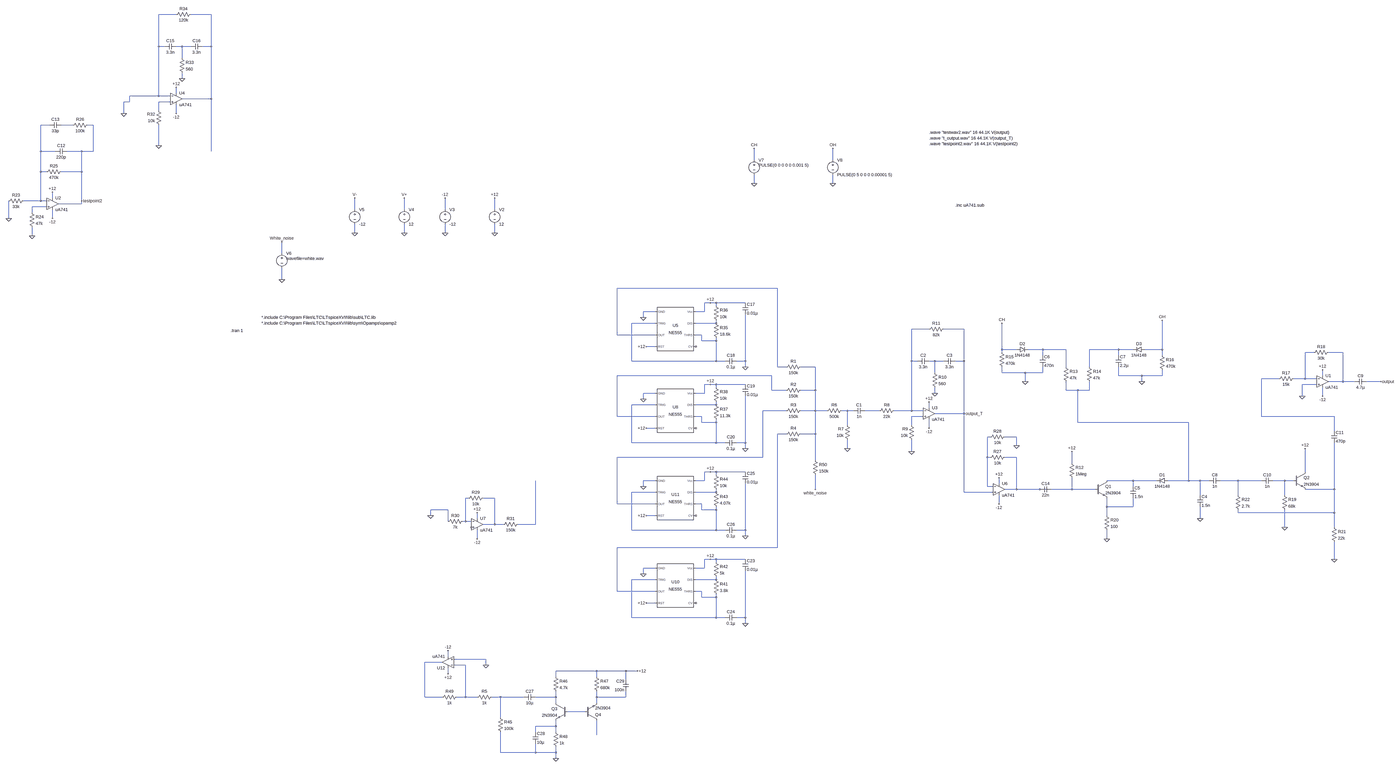
[diagram p0: schematic Hi Hat Cymbal (With white noise wave file).asc, whole sheet]
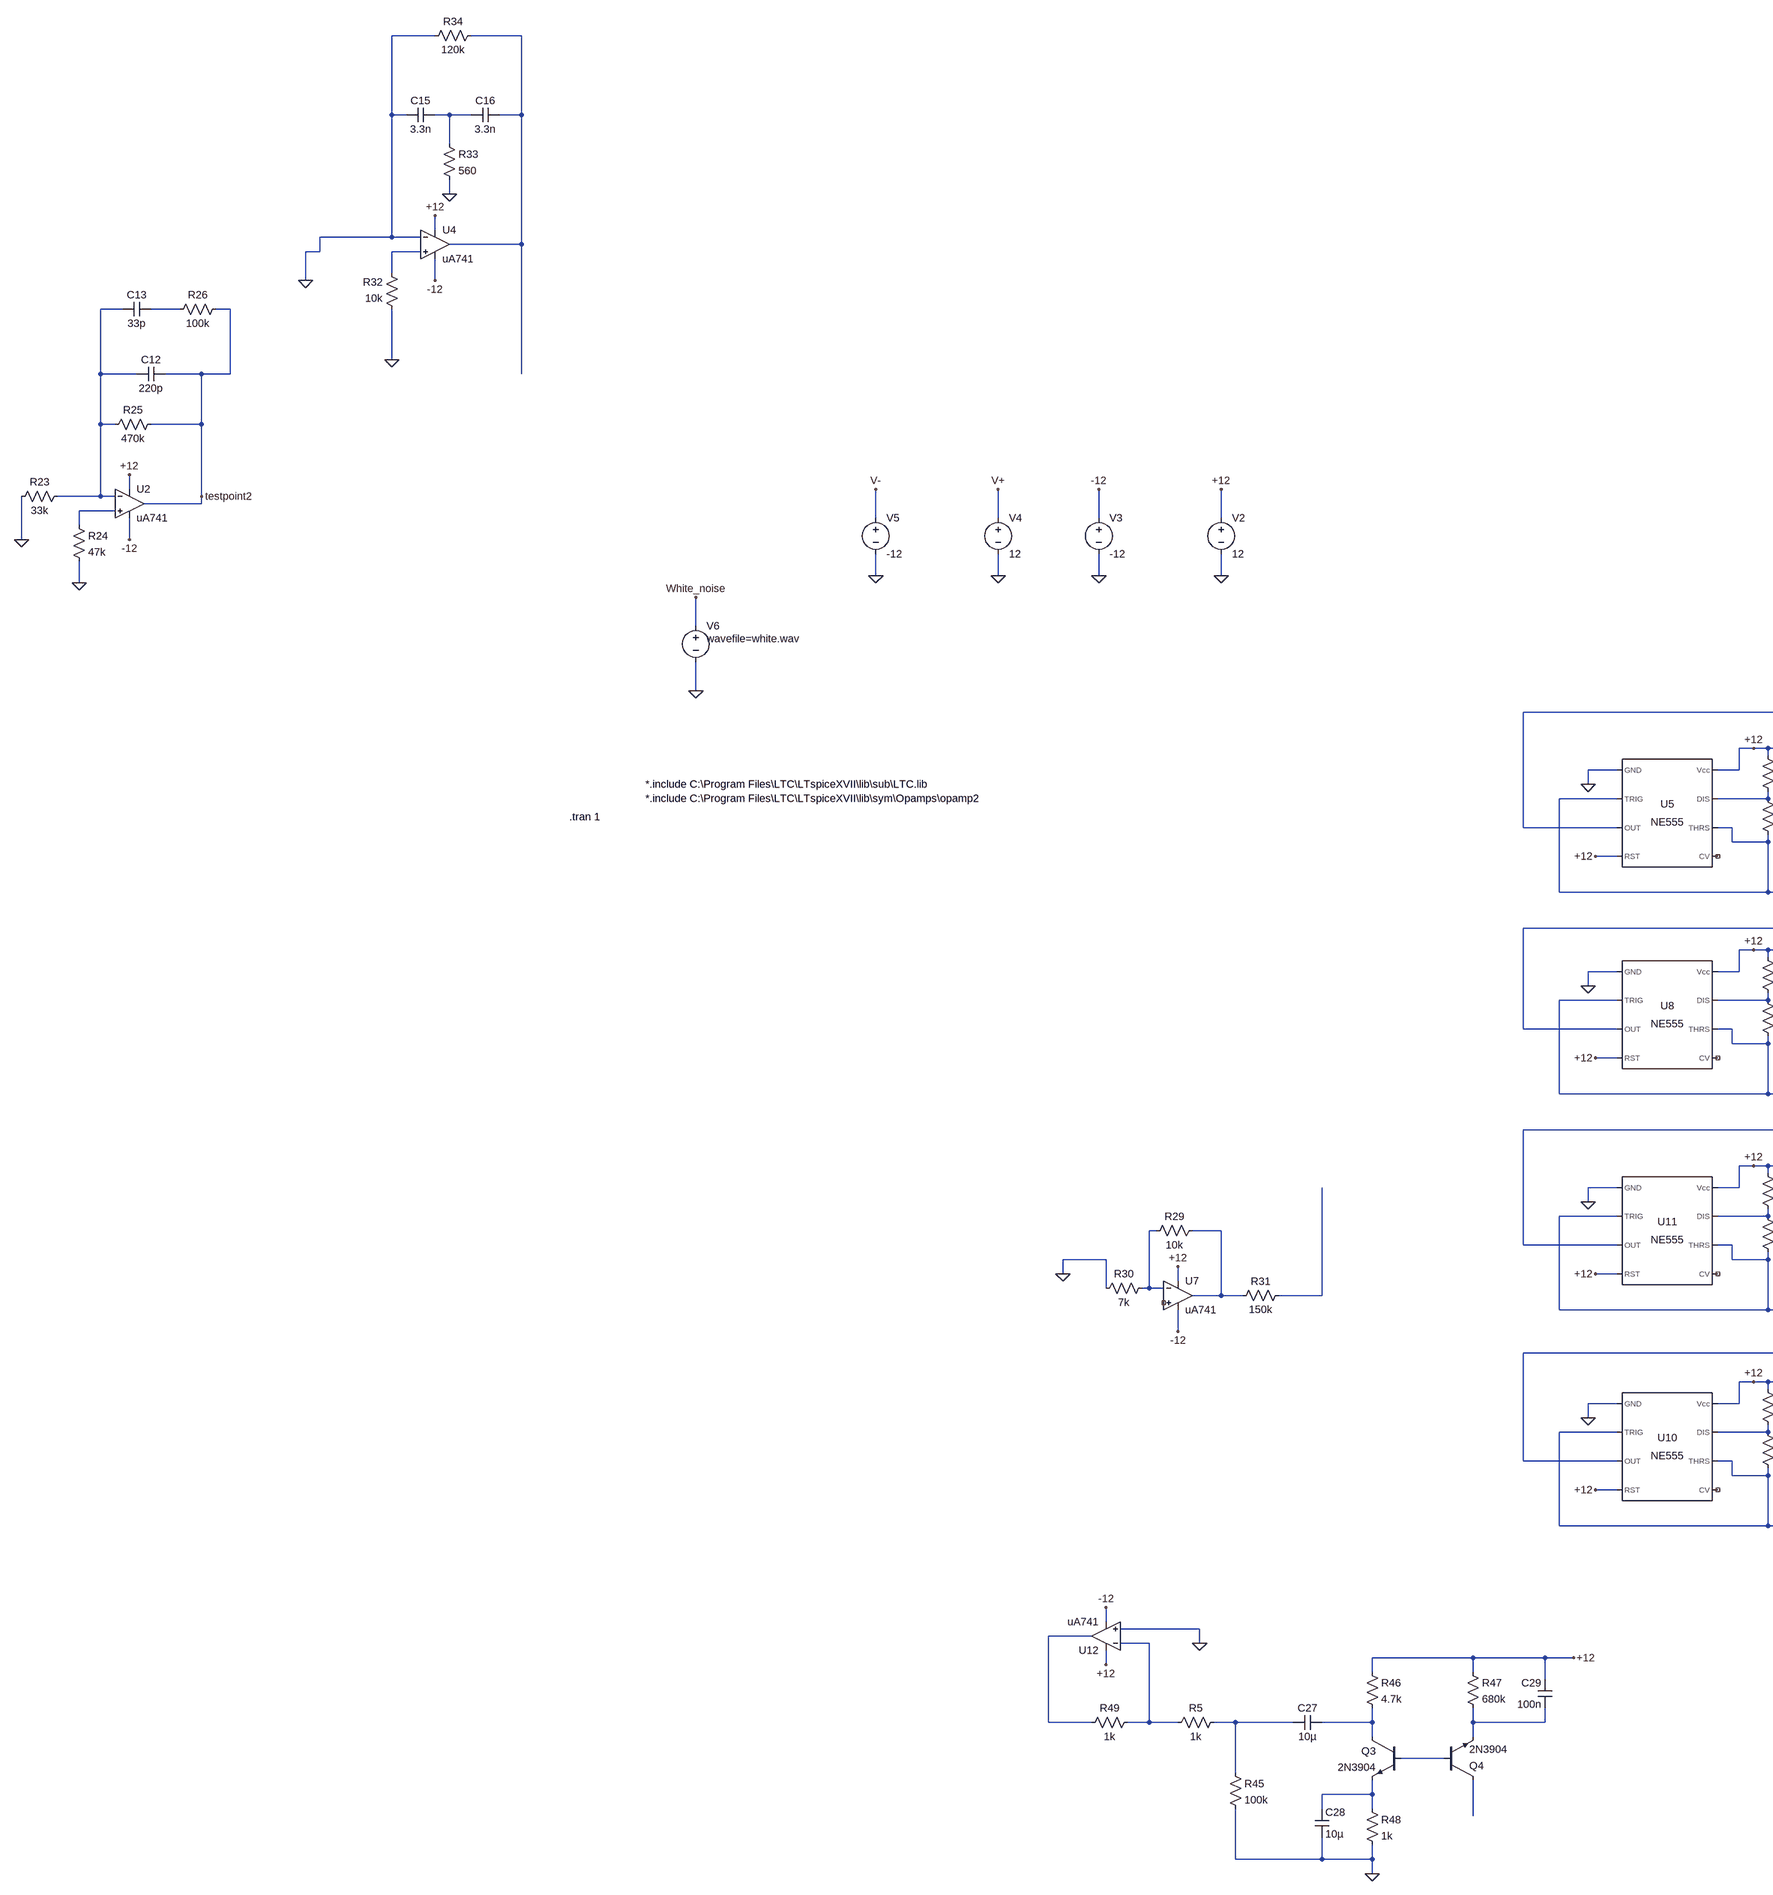
[diagram p1: schematic Hi Hat Cymbal (With white noise wave file).asc, part, row 1 of 1, column 1 of 2]
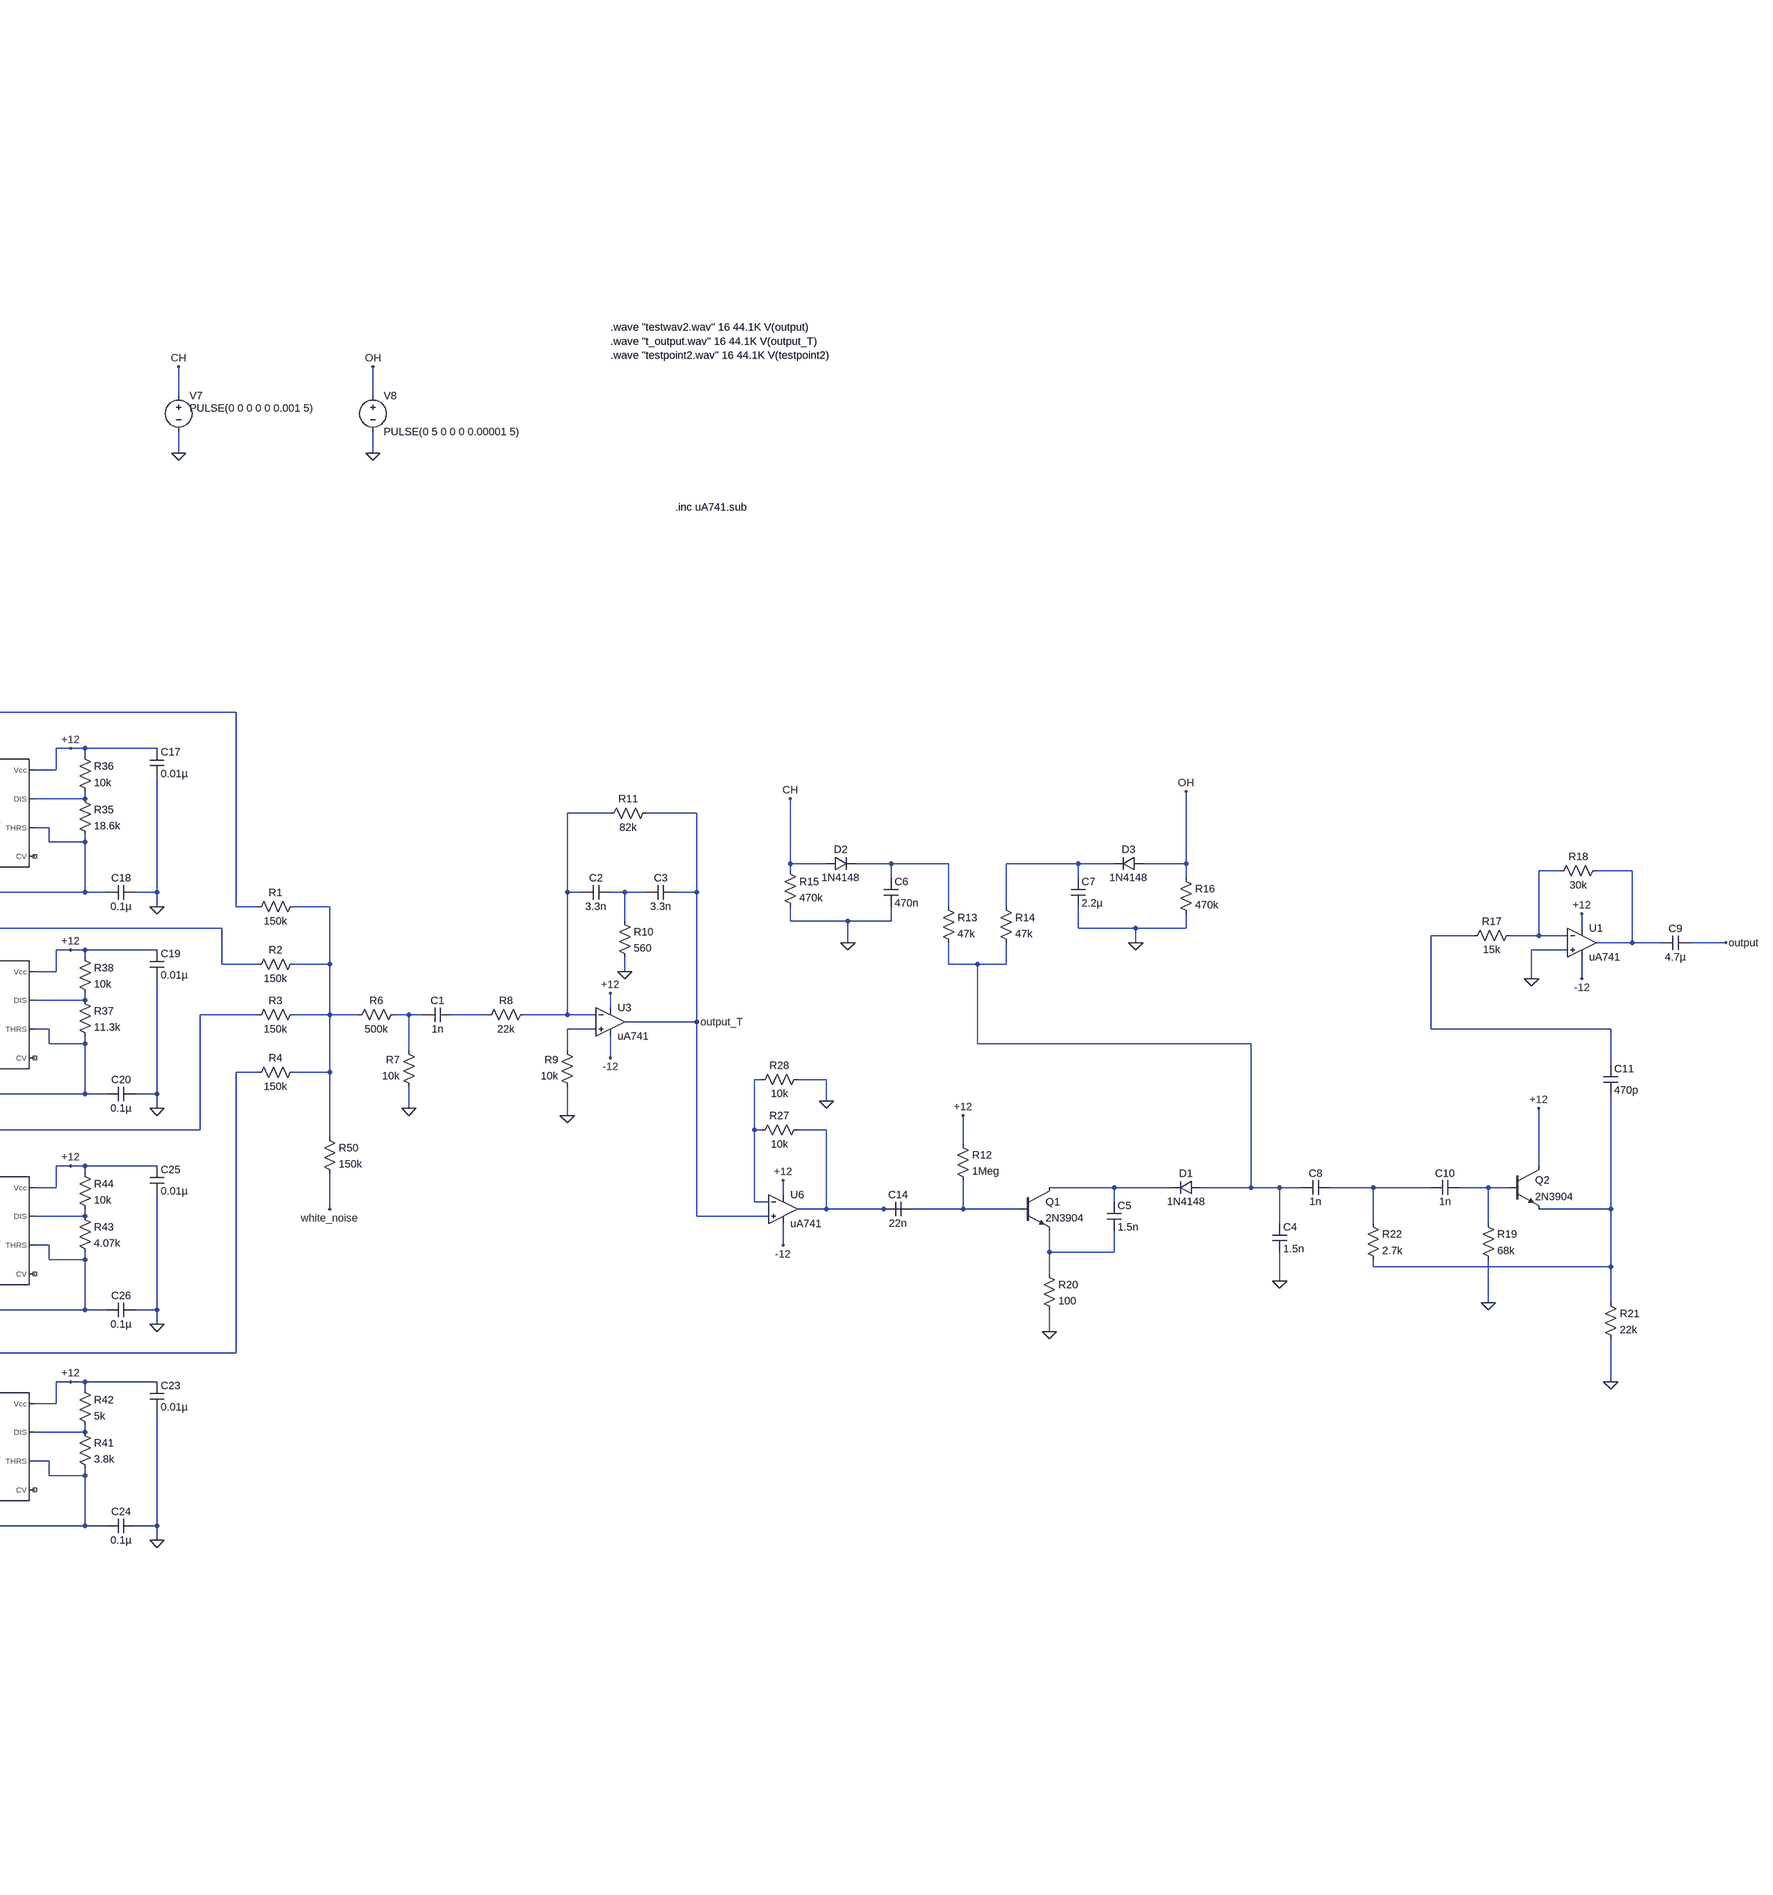
[diagram p2: schematic Hi Hat Cymbal (With white noise wave file).asc, part, row 1 of 1, column 2 of 2]
Hi Hat Cymbal (With white noise wave file).asc, the LTspice schematic file:
Version 4
SHEET 1 5820 2708
WIRE -4880 -1824 -4976 -1824
WIRE -4688 -1824 -4800 -1824
WIRE -4976 -1648 -4976 -1824
WIRE -4944 -1648 -4976 -1648
WIRE -4848 -1648 -4880 -1648
WIRE -4800 -1648 -4848 -1648
WIRE -4688 -1648 -4688 -1824
WIRE -4688 -1648 -4736 -1648
WIRE -4848 -1584 -4848 -1648
WIRE -4848 -1472 -4848 -1504
WIRE -4880 -1392 -4880 -1424
WIRE -4976 -1376 -4976 -1648
WIRE -4976 -1376 -5136 -1376
WIRE -4912 -1376 -4976 -1376
WIRE -4688 -1360 -4688 -1648
WIRE -4688 -1360 -4848 -1360
WIRE -5136 -1344 -5136 -1376
WIRE -5136 -1344 -5168 -1344
WIRE -4912 -1344 -4976 -1344
WIRE -4976 -1296 -4976 -1344
WIRE -5168 -1280 -5168 -1344
WIRE -4880 -1280 -4880 -1328
WIRE -6112 -1216 -6160 -1216
WIRE -5984 -1216 -6048 -1216
WIRE -5872 -1216 -5904 -1216
WIRE -4976 -1104 -4976 -1216
WIRE -6160 -1072 -6160 -1216
WIRE -6080 -1072 -6160 -1072
WIRE -5936 -1072 -6016 -1072
WIRE -5872 -1072 -5872 -1216
WIRE -5872 -1072 -5936 -1072
WIRE -4688 -1072 -4688 -1360
WIRE -128 -1024 -128 -1088
WIRE 304 -1024 304 -1088
WIRE -6160 -960 -6160 -1072
WIRE -6128 -960 -6160 -960
WIRE -5936 -960 -5936 -1072
WIRE -5936 -960 -6048 -960
WIRE -128 -896 -128 -944
WIRE 304 -896 304 -944
WIRE -6096 -816 -6096 -848
WIRE -6160 -800 -6160 -960
WIRE -6160 -800 -6256 -800
WIRE -6128 -800 -6160 -800
WIRE -5936 -800 -5936 -960
WIRE -5936 -784 -5936 -800
WIRE -5936 -784 -6064 -784
WIRE -6128 -768 -6208 -768
WIRE -2320 -752 -2320 -816
WIRE -2048 -752 -2048 -816
WIRE -1824 -752 -1824 -816
WIRE -1552 -752 -1552 -816
WIRE -6208 -736 -6208 -768
WIRE -6336 -704 -6336 -800
WIRE -6096 -704 -6096 -752
WIRE -2320 -624 -2320 -672
WIRE -2048 -624 -2048 -672
WIRE -1824 -624 -1824 -672
WIRE -1552 -624 -1552 -672
WIRE -6208 -608 -6208 -656
WIRE -2720 -512 -2720 -576
WIRE -2720 -368 -2720 -432
WIRE 0 -320 -880 -320
WIRE -368 -240 -400 -240
WIRE -336 -240 -368 -240
WIRE -176 -240 -336 -240
WIRE -336 -224 -336 -240
WIRE -672 -192 -736 -192
WIRE -400 -192 -400 -240
WIRE -400 -192 -448 -192
WIRE -736 -160 -736 -192
WIRE -672 -128 -800 -128
WIRE -336 -128 -336 -144
WIRE -336 -128 -448 -128
WIRE 832 -96 736 -96
WIRE 1024 -96 912 -96
WIRE -880 -64 -880 -320
WIRE -672 -64 -880 -64
WIRE -416 -64 -448 -64
WIRE -416 -32 -416 -64
WIRE -336 -32 -336 -48
WIRE -336 -32 -416 -32
WIRE -672 0 -720 0
WIRE 1232 16 1232 -128
WIRE 1312 16 1232 16
WIRE 1456 16 1376 16
WIRE 1584 16 1456 16
WIRE 1872 16 1712 16
WIRE 1952 16 1872 16
WIRE 2112 16 2112 -144
WIRE 2112 16 2016 16
WIRE 1232 32 1232 16
WIRE 2944 32 2896 32
WIRE 3104 32 3024 32
WIRE 1456 48 1456 16
WIRE 1872 48 1872 16
WIRE 2112 48 2112 16
WIRE -800 80 -800 -128
WIRE -336 80 -336 -32
WIRE -336 80 -800 80
WIRE -288 80 -336 80
WIRE -176 80 -176 -176
WIRE -176 80 -224 80
WIRE 736 80 736 -96
WIRE 768 80 736 80
WIRE 864 80 832 80
WIRE 912 80 864 80
WIRE 1024 80 1024 -96
WIRE 1024 80 976 80
WIRE -176 112 -176 80
WIRE 0 112 0 -320
WIRE 48 112 0 112
WIRE 208 112 128 112
WIRE 1584 112 1584 16
WIRE 1712 112 1712 16
WIRE 864 144 864 80
WIRE 1232 144 1232 112
WIRE 1360 144 1232 144
WIRE 1456 144 1456 112
WIRE 1456 144 1360 144
WIRE -32 160 -880 160
WIRE 1872 160 1872 112
WIRE 2000 160 1872 160
WIRE 2112 160 2112 128
WIRE 2112 160 2000 160
WIRE 2992 160 2992 128
WIRE 2752 176 2656 176
WIRE 2896 176 2896 32
WIRE 2896 176 2832 176
WIRE 2960 176 2896 176
WIRE 1360 192 1360 144
WIRE 2000 192 2000 160
WIRE 3104 192 3104 32
WIRE 3104 192 3024 192
WIRE 3168 192 3104 192
WIRE 3312 192 3232 192
WIRE -368 208 -400 208
WIRE -336 208 -368 208
WIRE -176 208 -336 208
WIRE 2960 208 2880 208
WIRE -336 224 -336 208
WIRE -32 240 -32 160
WIRE 48 240 -32 240
WIRE 208 240 208 112
WIRE 208 240 128 240
WIRE 1584 240 1584 192
WIRE 1648 240 1584 240
WIRE 1712 240 1712 192
WIRE 1712 240 1648 240
WIRE -672 256 -736 256
WIRE -400 256 -400 208
WIRE -400 256 -448 256
WIRE 864 256 864 224
WIRE 2880 272 2880 208
WIRE 2992 272 2992 224
WIRE -736 288 -736 256
WIRE -672 320 -800 320
WIRE -336 320 -336 304
WIRE -336 320 -448 320
WIRE 832 336 832 304
WIRE 48 352 -80 352
WIRE 208 352 208 240
WIRE 208 352 128 352
WIRE 272 352 208 352
WIRE 384 352 352 352
WIRE 416 352 384 352
WIRE 560 352 480 352
WIRE 736 352 736 80
WIRE 736 352 640 352
WIRE 800 352 736 352
WIRE 1024 368 1024 80
WIRE 1024 368 864 368
WIRE -880 384 -880 160
WIRE -672 384 -880 384
WIRE -416 384 -448 384
WIRE 800 384 736 384
WIRE 2656 384 2656 176
WIRE 3056 384 2656 384
WIRE -416 416 -416 384
WIRE -336 416 -336 400
WIRE -336 416 -416 416
WIRE 1648 416 1648 240
WIRE 2256 416 1648 416
WIRE 384 432 384 352
WIRE 736 432 736 384
WIRE -672 448 -720 448
WIRE 832 448 832 400
WIRE 3056 464 3056 384
WIRE 48 480 0 480
WIRE 208 480 208 352
WIRE 208 480 128 480
WIRE 1168 496 1152 496
WIRE 1312 496 1248 496
WIRE -800 528 -800 320
WIRE -336 528 -336 416
WIRE -336 528 -800 528
WIRE -288 528 -336 528
WIRE -176 528 -176 272
WIRE -176 528 -224 528
WIRE 1312 544 1312 496
WIRE -176 560 -176 528
WIRE 384 560 384 512
WIRE 736 576 736 512
WIRE -80 608 -80 352
WIRE -80 608 -880 608
WIRE 1152 608 1152 496
WIRE 1168 608 1152 608
WIRE 1312 608 1248 608
WIRE 208 624 208 480
WIRE 1616 640 1616 576
WIRE -368 688 -400 688
WIRE -336 688 -368 688
WIRE -176 688 -336 688
WIRE 2896 688 2896 560
WIRE -336 704 -336 688
WIRE -672 736 -736 736
WIRE -400 736 -400 688
WIRE -400 736 -448 736
WIRE 1952 736 1808 736
WIRE 2080 736 1952 736
WIRE 2256 736 2256 416
WIRE 2256 736 2144 736
WIRE 2320 736 2256 736
WIRE 2368 736 2320 736
WIRE 2528 736 2432 736
WIRE 2656 736 2528 736
WIRE 2784 736 2720 736
WIRE 2832 736 2784 736
WIRE 1216 752 1216 720
WIRE -736 768 -736 736
WIRE 1152 768 1152 608
WIRE 1184 768 1152 768
WIRE 1952 768 1952 736
WIRE 208 784 208 704
WIRE 1312 784 1312 608
WIRE 1312 784 1248 784
WIRE 1440 784 1312 784
WIRE 1488 784 1440 784
WIRE 1616 784 1616 720
WIRE 1616 784 1504 784
WIRE 1744 784 1616 784
WIRE 3056 784 3056 528
WIRE 3056 784 2896 784
WIRE -672 800 -800 800
WIRE -336 800 -336 784
WIRE -336 800 -448 800
WIRE 1024 800 1024 368
WIRE 1184 800 1024 800
WIRE 2320 816 2320 736
WIRE 2528 816 2528 736
WIRE 2784 816 2784 736
WIRE -1696 832 -1712 832
WIRE -1552 832 -1616 832
WIRE -880 864 -880 608
WIRE -672 864 -880 864
WIRE -416 864 -448 864
WIRE 1216 864 1216 816
WIRE 1808 880 1808 832
WIRE 1952 880 1952 832
WIRE 1952 880 1808 880
WIRE -1808 896 -1904 896
WIRE -416 896 -416 864
WIRE -336 896 -336 880
WIRE -336 896 -416 896
WIRE 2528 912 2528 896
WIRE 3056 912 3056 784
WIRE 3056 912 2528 912
WIRE -1904 928 -1904 896
WIRE -672 928 -720 928
WIRE 1808 928 1808 880
WIRE -1648 944 -1648 912
WIRE 2320 944 2320 880
WIRE -1808 960 -1808 896
WIRE -1712 960 -1712 832
WIRE -1712 960 -1728 960
WIRE -1680 960 -1712 960
WIRE -1552 976 -1552 832
WIRE -1552 976 -1616 976
WIRE -1504 976 -1552 976
WIRE -1328 976 -1328 736
WIRE -1328 976 -1424 976
WIRE 2784 992 2784 896
WIRE 3056 992 3056 912
WIRE -800 1008 -800 800
WIRE -336 1008 -336 896
WIRE -336 1008 -800 1008
WIRE -288 1008 -336 1008
WIRE -176 1008 -176 752
WIRE -176 1008 -224 1008
WIRE -176 1040 -176 1008
WIRE -1648 1056 -1648 1008
WIRE 1808 1056 1808 1008
WIRE 0 1104 0 480
WIRE 0 1104 -880 1104
WIRE -368 1168 -400 1168
WIRE -336 1168 -368 1168
WIRE -176 1168 -336 1168
WIRE 3056 1168 3056 1072
WIRE -336 1184 -336 1168
WIRE -672 1216 -736 1216
WIRE -400 1216 -400 1168
WIRE -400 1216 -448 1216
WIRE -736 1248 -736 1216
WIRE -672 1280 -800 1280
WIRE -336 1280 -336 1264
WIRE -336 1280 -448 1280
WIRE -880 1344 -880 1104
WIRE -672 1344 -880 1344
WIRE -416 1344 -448 1344
WIRE -416 1376 -416 1344
WIRE -336 1376 -336 1360
WIRE -336 1376 -416 1376
WIRE -672 1408 -720 1408
WIRE -800 1488 -800 1280
WIRE -336 1488 -336 1376
WIRE -336 1488 -800 1488
WIRE -288 1488 -336 1488
WIRE -176 1488 -176 1232
WIRE -176 1488 -224 1488
WIRE -176 1520 -176 1488
WIRE -1808 1856 -1808 1824
WIRE -1600 1872 -1776 1872
WIRE -1840 1888 -1936 1888
WIRE -1712 1904 -1776 1904
WIRE -1600 1904 -1600 1872
WIRE -992 1936 -1216 1936
WIRE -832 1936 -992 1936
WIRE -768 1936 -832 1936
WIRE -1808 1952 -1808 1920
WIRE -1216 1968 -1216 1936
WIRE -992 1968 -992 1936
WIRE -832 1984 -832 1936
WIRE -1936 2080 -1936 1888
WIRE -1840 2080 -1936 2080
WIRE -1712 2080 -1712 1904
WIRE -1712 2080 -1760 2080
WIRE -1648 2080 -1712 2080
WIRE -1520 2080 -1568 2080
WIRE -1392 2080 -1520 2080
WIRE -1216 2080 -1216 2048
WIRE -1216 2080 -1328 2080
WIRE -992 2080 -992 2048
WIRE -832 2080 -832 2048
WIRE -832 2080 -992 2080
WIRE -1216 2112 -1216 2080
WIRE -992 2112 -992 2080
WIRE -1056 2160 -1152 2160
WIRE -1520 2192 -1520 2080
WIRE -1216 2240 -1216 2208
WIRE -1216 2240 -1328 2240
WIRE -1328 2272 -1328 2240
WIRE -1216 2272 -1216 2240
WIRE -992 2288 -992 2208
WIRE -1520 2384 -1520 2272
WIRE -1328 2384 -1328 2336
WIRE -1328 2384 -1520 2384
WIRE -1216 2384 -1216 2352
WIRE -1216 2384 -1328 2384
WIRE -1216 2416 -1216 2384
FLAG 384 560 0
FLAG 736 576 0
FLAG 864 256 0
FLAG 1616 576 +12
FLAG -1552 -624 0
FLAG -1824 -624 0
FLAG -1552 -816 +12
FLAG -1824 -816 -12
FLAG 832 448 -12
FLAG 832 304 +12
FLAG 1360 192 0
FLAG 1232 -128 CH
FLAG 2112 -144 OH
FLAG 2000 192 0
FLAG -2048 -624 0
FLAG -2320 -624 0
FLAG -2048 -816 V+
FLAG -2320 -816 V-
FLAG -2720 -368 0
FLAG -2720 -576 White_noise
FLAG 2992 272 -12
FLAG 2992 128 +12
FLAG 2880 272 0
FLAG -128 -896 0
FLAG -128 -1088 CH
FLAG 3312 192 output
FLAG 304 -896 0
FLAG 304 -1088 OH
FLAG 1024 368 output_T
FLAG 1808 1056 0
FLAG -5936 -800 testpoint2
FLAG 1216 864 -12
FLAG 1216 720 +12
FLAG -1648 1056 -12
FLAG -1648 912 +12
FLAG -1904 928 0
FLAG 2320 944 0
FLAG 2896 560 +12
FLAG 2784 992 0
FLAG 3056 1168 0
FLAG -6096 -704 -12
FLAG -6096 -848 +12
FLAG -6208 -608 0
FLAG -4976 -1104 0
FLAG -4848 -1472 0
FLAG -4880 -1280 -12
FLAG -4880 -1424 +12
FLAG -5168 -1280 0
FLAG -6336 -704 0
FLAG -736 -160 0
FLAG -368 -240 +12
FLAG -720 0 +12
FLAG -176 112 0
FLAG -736 288 0
FLAG -368 208 +12
FLAG -720 448 +12
FLAG -176 560 0
FLAG -736 1248 0
FLAG -368 1168 +12
FLAG -720 1408 +12
FLAG -176 1520 0
FLAG -736 768 0
FLAG -368 688 +12
FLAG -720 928 +12
FLAG -176 1040 0
FLAG -1216 2416 0
FLAG -768 1936 +12
FLAG -1808 1824 -12
FLAG -1808 1952 +12
FLAG -1600 1904 0
FLAG 1312 544 0
FLAG 208 784 white_noise
SYMBOL res 144 96 R90
WINDOW 0 0 56 VBottom 2
WINDOW 3 32 56 VTop 2
SYMATTR InstName R1
SYMATTR Value 150k
SYMBOL res 144 224 R90
WINDOW 0 0 56 VBottom 2
WINDOW 3 32 56 VTop 2
SYMATTR InstName R2
SYMATTR Value 150k
SYMBOL res 144 336 R90
WINDOW 0 0 56 VBottom 2
WINDOW 3 32 56 VTop 2
SYMATTR InstName R3
SYMATTR Value 150k
SYMBOL res 144 464 R90
WINDOW 0 0 56 VBottom 2
WINDOW 3 32 56 VTop 2
SYMATTR InstName R4
SYMATTR Value 150k
SYMBOL res 368 336 R90
WINDOW 0 0 56 VBottom 2
WINDOW 3 32 56 VTop 2
SYMATTR InstName R6
SYMATTR Value 500k
SYMBOL res 400 528 R180
WINDOW 0 36 76 Left 2
WINDOW 3 36 40 Left 2
SYMATTR InstName R7
SYMATTR Value 10k
SYMBOL cap 480 336 R90
WINDOW 0 0 32 VBottom 2
WINDOW 3 32 32 VTop 2
SYMATTR InstName C1
SYMATTR Value 1n
SYMBOL res 656 336 R90
WINDOW 0 0 56 VBottom 2
WINDOW 3 32 56 VTop 2
SYMATTR InstName R8
SYMATTR Value 22k
SYMBOL res 752 528 R180
WINDOW 0 36 76 Left 2
WINDOW 3 36 40 Left 2
SYMATTR InstName R9
SYMATTR Value 10k
SYMBOL cap 832 64 R90
WINDOW 0 0 32 VBottom 2
WINDOW 3 32 32 VTop 2
SYMATTR InstName C2
SYMATTR Value 3.3n
SYMBOL cap 976 64 R90
WINDOW 0 0 32 VBottom 2
WINDOW 3 32 32 VTop 2
SYMATTR InstName C3
SYMATTR Value 3.3n
SYMBOL res 848 128 R0
SYMATTR InstName R10
SYMATTR Value 560
SYMBOL res 928 -112 R90
WINDOW 0 0 56 VBottom 2
WINDOW 3 32 56 VTop 2
SYMATTR InstName R11
SYMATTR Value 82k
SYMBOL res 1600 624 R0
SYMATTR InstName R12
SYMATTR Value 1Meg
SYMBOL npn 1744 736 R0
SYMATTR InstName Q1
SYMATTR Value 2N3904
SYMBOL cap 1936 768 R0
SYMATTR InstName C5
SYMATTR Value 1.5n
SYMBOL voltage -1552 -768 R0
WINDOW 123 0 0 Left 2
WINDOW 39 0 0 Left 2
SYMATTR InstName V2
SYMATTR Value 12
SYMBOL voltage -1824 -768 R0
WINDOW 123 0 0 Left 2
WINDOW 39 0 0 Left 2
SYMATTR InstName V3
SYMATTR Value -12
SYMBOL diode 2144 720 R90
WINDOW 0 0 32 VBottom 2
WINDOW 3 32 32 VTop 2
SYMATTR InstName D1
SYMATTR Value 1N4148
SYMBOL res 1568 96 R0
SYMATTR InstName R13
SYMATTR Value 47k
SYMBOL res 1696 96 R0
SYMATTR InstName R14
SYMATTR Value 47k
SYMBOL cap 1440 48 R0
SYMATTR InstName C6
SYMATTR Value 470n
SYMBOL diode 1312 32 R270
WINDOW 0 32 32 VTop 2
WINDOW 3 0 32 VBottom 2
SYMATTR InstName D2
SYMATTR Value 1N4148
SYMBOL res 1216 16 R0
SYMATTR InstName R15
SYMATTR Value 470k
SYMBOL cap 1856 48 R0
SYMATTR InstName C7
SYMATTR Value 2.2µ
SYMBOL diode 2016 0 R90
WINDOW 0 0 32 VBottom 2
WINDOW 3 32 32 VTop 2
SYMATTR InstName D3
SYMATTR Value 1N4148
SYMBOL res 2096 32 R0
SYMATTR InstName R16
SYMATTR Value 470k
SYMBOL cap 2432 720 R90
WINDOW 0 0 32 VBottom 2
WINDOW 3 32 32 VTop 2
SYMATTR InstName C8
SYMATTR Value 1n
SYMBOL voltage -2048 -768 R0
WINDOW 123 0 0 Left 2
WINDOW 39 0 0 Left 2
SYMATTR InstName V4
SYMATTR Value 12
SYMBOL voltage -2320 -768 R0
WINDOW 123 0 0 Left 2
WINDOW 39 0 0 Left 2
SYMATTR InstName V5
SYMATTR Value -12
SYMBOL voltage -2720 -528 R0
WINDOW 3 24 44 Left 2
SYMATTR Value wavefile=white.wav
SYMATTR InstName V6
SYMBOL res 2848 160 R90
WINDOW 0 0 56 VBottom 2
WINDOW 3 32 56 VTop 2
SYMATTR InstName R17
SYMATTR Value 15k
SYMBOL res 3040 16 R90
WINDOW 0 0 56 VBottom 2
WINDOW 3 32 56 VTop 2
SYMATTR InstName R18
SYMATTR Value 30k
SYMBOL cap 3232 176 R90
WINDOW 0 0 32 VBottom 2
WINDOW 3 32 32 VTop 2
SYMATTR InstName C9
SYMATTR Value 4.7µ
SYMBOL voltage -128 -1040 R0
WINDOW 123 0 0 Left 2
WINDOW 39 0 0 Left 2
WINDOW 3 24 44 Left 2
SYMATTR Value PULSE(0 0 0 0 0 0.001 5)
SYMATTR InstName V7
SYMBOL voltage 304 -1040 R0
WINDOW 123 0 0 Left 2
WINDOW 39 0 0 Left 2
SYMATTR InstName V8
SYMATTR Value PULSE(0 5 0 0 0 0.00001 5)
SYMBOL Opamps\\opamp2 832 304 R0
SYMATTR InstName U3
SYMATTR Value uA741
SYMBOL Opamps\\opamp2 2992 128 R0
SYMATTR InstName U1
SYMATTR Value uA741
SYMBOL res 1792 912 R0
SYMATTR InstName R20
SYMATTR Value 100
SYMBOL Opamps\\opamp2 1216 720 R0
SYMATTR InstName U6
SYMATTR Value uA741
SYMBOL res 1264 592 R90
WINDOW 0 0 56 VBottom 2
WINDOW 3 32 56 VTop 2
SYMATTR InstName R27
SYMATTR Value 10k
SYMBOL res 1152 512 R270
WINDOW 0 32 56 VTop 2
WINDOW 3 0 56 VBottom 2
SYMATTR InstName R28
SYMATTR Value 10k
SYMBOL cap 1504 768 R90
WINDOW 0 0 32 VBottom 2
WINDOW 3 32 32 VTop 2
SYMATTR InstName C14
SYMATTR Value 22n
SYMBOL Opamps\\opamp2 -1648 912 R0
SYMATTR InstName U7
SYMATTR Value uA741
SYMBOL res -1600 816 R90
WINDOW 0 0 56 VBottom 2
WINDOW 3 32 56 VTop 2
SYMATTR InstName R29
SYMATTR Value 10k
SYMBOL res -1712 944 R90
WINDOW 0 0 56 VBottom 2
WINDOW 3 32 56 VTop 2
SYMATTR InstName R30
SYMATTR Value 7k
SYMBOL res -1408 960 R90
WINDOW 0 0 56 VBottom 2
WINDOW 3 32 56 VTop 2
SYMATTR InstName R31
SYMATTR Value 150k
SYMBOL cap 2304 816 R0
SYMATTR InstName C4
SYMATTR Value 1.5n
SYMBOL cap 2720 720 R90
WINDOW 0 0 32 VBottom 2
WINDOW 3 32 32 VTop 2
SYMATTR InstName C10
SYMATTR Value 1n
SYMBOL npn 2832 688 R0
SYMATTR InstName Q2
SYMATTR Value 2N3904
SYMBOL res 2768 800 R0
SYMATTR InstName R19
SYMATTR Value 68k
SYMBOL res 3040 976 R0
SYMATTR InstName R21
SYMATTR Value 22k
SYMBOL res 2512 800 R0
SYMATTR InstName R22
SYMATTR Value 2.7k
SYMBOL cap 3040 464 R0
SYMATTR InstName C11
SYMATTR Value 470p
SYMBOL Opamps\\opamp2 -6096 -848 R0
SYMATTR InstName U2
SYMATTR Value uA741
SYMBOL res -6240 -816 R90
WINDOW 0 0 56 VBottom 2
WINDOW 3 32 56 VTop 2
SYMATTR InstName R23
SYMATTR Value 33k
SYMBOL res -6224 -752 R0
SYMATTR InstName R24
SYMATTR Value 47k
SYMBOL res -6032 -976 R90
WINDOW 0 0 56 VBottom 2
WINDOW 3 32 56 VTop 2
SYMATTR InstName R25
SYMATTR Value 470k
SYMBOL cap -6016 -1088 R90
WINDOW 0 0 32 VBottom 2
WINDOW 3 32 32 VTop 2
SYMATTR InstName C12
SYMATTR Value 220p
SYMBOL res -5888 -1232 R90
WINDOW 0 0 56 VBottom 2
WINDOW 3 32 56 VTop 2
SYMATTR InstName R26
SYMATTR Value 100k
SYMBOL cap -6048 -1232 R90
WINDOW 0 0 32 VBottom 2
WINDOW 3 32 32 VTop 2
SYMATTR InstName C13
SYMATTR Value 33p
SYMBOL res -4960 -1200 R180
WINDOW 0 36 76 Left 2
WINDOW 3 36 40 Left 2
SYMATTR InstName R32
SYMATTR Value 10k
SYMBOL cap -4880 -1664 R90
WINDOW 0 0 32 VBottom 2
WINDOW 3 32 32 VTop 2
SYMATTR InstName C15
SYMATTR Value 3.3n
SYMBOL cap -4736 -1664 R90
WINDOW 0 0 32 VBottom 2
WINDOW 3 32 32 VTop 2
SYMATTR InstName C16
SYMATTR Value 3.3n
SYMBOL res -4864 -1600 R0
SYMATTR InstName R33
SYMATTR Value 560
SYMBOL res -4784 -1840 R90
WINDOW 0 0 56 VBottom 2
WINDOW 3 32 56 VTop 2
SYMATTR InstName R34
SYMATTR Value 120k
SYMBOL Opamps\\opamp2 -4880 -1424 R0
SYMATTR InstName U4
SYMATTR Value uA741
SYMBOL Misc\\NE555 -560 -96 R0
SYMATTR InstName U5
SYMBOL res -352 -144 R0
SYMATTR InstName R35
SYMATTR Value 18.6k
SYMBOL res -352 -240 R0
SYMATTR InstName R36
SYMATTR Value 10k
SYMBOL cap -192 -240 R0
SYMATTR InstName C17
SYMATTR Value 0.01µ
SYMBOL cap -224 64 R90
WINDOW 0 0 32 VBottom 2
WINDOW 3 32 32 VTop 2
SYMATTR InstName C18
SYMATTR Value 0.1µ
SYMBOL Misc\\NE555 -560 352 R0
SYMATTR InstName U8
SYMBOL res -352 304 R0
SYMATTR InstName R37
SYMATTR Value 11.3k
SYMBOL res -352 208 R0
SYMATTR InstName R38
SYMATTR Value 10k
SYMBOL cap -192 208 R0
SYMATTR InstName C19
SYMATTR Value 0.01µ
SYMBOL cap -224 512 R90
WINDOW 0 0 32 VBottom 2
WINDOW 3 32 32 VTop 2
SYMATTR InstName C20
SYMATTR Value 0.1µ
SYMBOL Misc\\NE555 -560 1312 R0
SYMATTR InstName U10
SYMBOL res -352 1264 R0
SYMATTR InstName R41
SYMATTR Value 3.8k
SYMBOL res -352 1168 R0
SYMATTR InstName R42
SYMATTR Value 5k
SYMBOL cap -192 1168 R0
SYMATTR InstName C23
SYMATTR Value 0.01µ
SYMBOL cap -224 1472 R90
WINDOW 0 0 32 VBottom 2
WINDOW 3 32 32 VTop 2
SYMATTR InstName C24
SYMATTR Value 0.1µ
SYMBOL Misc\\NE555 -560 832 R0
SYMATTR InstName U11
SYMBOL res -352 784 R0
SYMATTR InstName R43
SYMATTR Value 4.07k
SYMBOL res -352 688 R0
SYMATTR InstName R44
SYMATTR Value 10k
SYMBOL cap -192 688 R0
SYMATTR InstName C25
SYMATTR Value 0.01µ
SYMBOL cap -224 992 R90
WINDOW 0 0 32 VBottom 2
WINDOW 3 32 32 VTop 2
SYMATTR InstName C26
SYMATTR Value 0.1µ
SYMBOL npn -1152 2112 M0
SYMATTR InstName Q3
SYMATTR Value 2N3904
SYMBOL res -1536 2176 R0
SYMATTR InstName R45
SYMATTR Value 100k
SYMBOL cap -1328 2064 R90
WINDOW 0 0 32 VBottom 2
WINDOW 3 32 32 VTop 2
SYMATTR InstName C27
SYMATTR Value 10µ
SYMBOL npn -1056 2208 M180
SYMATTR InstName Q4
SYMATTR Value 2N3904
SYMBOL res -1232 1952 R0
SYMATTR InstName R46
SYMATTR Value 4.7k
SYMBOL res -1008 1952 R0
SYMATTR InstName R47
SYMATTR Value 680k
SYMBOL res -1232 2256 R0
SYMATTR InstName R48
SYMATTR Value 1k
SYMBOL cap -1344 2272 R0
SYMATTR InstName C28
SYMATTR Value 10µ
SYMBOL cap -816 2048 R180
WINDOW 0 24 56 Left 2
WINDOW 3 24 8 Left 2
SYMATTR InstName C29
SYMATTR Value 100n
SYMBOL Opamps\\opamp2 -1808 1952 R180
SYMATTR InstName U12
SYMATTR Value uA741
SYMBOL res -1664 2096 R270
WINDOW 0 32 56 VTop 2
WINDOW 3 0 56 VBottom 2
SYMATTR InstName R5
SYMATTR Value 1k
SYMBOL res -1744 2064 R90
WINDOW 0 0 56 VBottom 2
WINDOW 3 32 56 VTop 2
SYMATTR InstName R49
SYMATTR Value 1k
SYMBOL res 192 608 R0
SYMATTR InstName R50
SYMATTR Value 150k
TEXT -3056 -88 Left 2 !.tran 1
TEXT -2832 -160 Left 2 !*.include C:\\Program Files\\LTC\\LTspiceXVII\\lib\\sub\\LTC.lib\n*.include C:\\Program Files\\LTC\\LTspiceXVII\\lib\\sym\\Opamps\\opamp2
TEXT 832 -1176 Left 2 !.wave "testwav2.wav" 16 44.1K V(output)\n.wave "t_output.wav" 16 44.1K V(output_T)\n.wave "testpoint2.wav" 16 44.1K V(testpoint2)
TEXT 976 -776 Left 2 !.inc uA741.sub

The netlist it stands for:
* Hi Hat Cymbal (With white noise wave file).asc
R1 N016 N007 150k
R2 N016 N017 150k
R3 N016 N022 150k
R4 N016 N026 150k
R6 N023 N016 500k
R7 0 N023 10k
C1 N024 N023 1n
R8 N010 N024 22k
R9 0 N025 10k
C2 N015 N010 3.3n
C3 output_T N015 3.3n
R10 N015 0 560
R11 output_T N010 82k
R12 +12 N032 1Meg
Q1 N029 N032 N038 0 2N3904
C5 N029 N038 1.5n
V2 +12 0 12
V3 -12 0 -12
D1 N019 N029 1N4148
R13 N011 N019 47k
R14 N012 N019 47k
C6 N011 0 470n
D2 CH N011 1N4148
R15 CH 0 470k
C7 N012 0 2.2µ
D3 OH N012 1N4148
R16 OH 0 470k
C8 N030 N019 1n
V4 V+ 0 12
V5 V- 0 -12
V6 White_noise 0 wavefile=white.wav
R17 N013 N018 15k
R18 N014 N013 30k
C9 output N014 4.7µ
V7 CH 0 PULSE(0 0 0 0 0 0.001 5)
V8 OH 0 PULSE(0 5 0 0 0 0.00001 5)
XU3 N025 N010 +12 -12 output_T uA741  ; pins In+ In- V+ V- OUT
XU1 0 N013 +12 -12 N014 uA741  ; pins In+ In- V+ V- OUT
R20 N038 0 100
XU6 output_T N027 +12 -12 N028 uA741  ; pins In+ In- V+ V- OUT
R27 N028 N027 10k
R28 N027 0 10k
C14 N032 N028 22n
XU7 NC_01 N036 +12 -12 N037 uA741  ; pins In+ In- V+ V- OUT
R29 N037 N036 10k
R30 N036 0 7k
R31 N039 N037 150k
C4 N019 0 1.5n
C10 N031 N030 1n
Q2 +12 N031 N033 0 2N3904
R19 N031 0 68k
R21 N033 0 22k
R22 N030 N033 2.7k
C11 N018 N033 470p
XU2 N006 N004 +12 -12 testpoint2 uA741  ; pins In+ In- V+ V- OUT
R23 N004 0 33k
R24 N006 0 47k
R25 testpoint2 N004 470k
C12 testpoint2 N004 220p
R26 testpoint2 N005 100k
C13 N005 N004 33p
R32 0 N003 10k
C15 N002 0 3.3n
C16 N001 N002 3.3n
R33 N002 0 560
R34 N001 0 120k
XU4 N003 0 +12 -12 N001 uA741  ; pins In+ In- V+ V- OUT
XU5 0 N008 N007 +12 NC_02 N008 N009 +12 NE555  ; pins GND TRIG OUT RST CV THRS DIS Vcc
R35 N009 N008 18.6k
R36 +12 N009 10k
C17 +12 0 0.01µ
C18 0 N008 0.1µ
XU8 0 N020 N017 +12 NC_03 N020 N021 +12 NE555  ; pins GND TRIG OUT RST CV THRS DIS Vcc
R37 N021 N020 11.3k
R38 +12 N021 10k
C19 +12 0 0.01µ
C20 0 N020 0.1µ
XU10 0 N040 N026 +12 NC_04 N040 N041 +12 NE555  ; pins GND TRIG OUT RST CV THRS DIS Vcc
R41 N041 N040 3.8k
R42 +12 N041 5k
C23 +12 0 0.01µ
C24 0 N040 0.1µ
XU11 0 N034 N022 +12 NC_05 N034 N035 +12 NE555  ; pins GND TRIG OUT RST CV THRS DIS Vcc
R43 N035 N034 4.07k
R44 +12 N035 10k
C25 +12 0 0.01µ
C26 0 N034 0.1µ
Q3 N045 N047 N048 0 2N3904
R45 N044 0 100k
C27 N045 N044 10µ
Q4 N049 N047 N046 0 2N3904
R46 +12 N045 4.7k
R47 +12 N046 680k
R48 N048 0 1k
C28 N048 0 10µ
C29 N046 +12 100n
XU12 0 N043 +12 -12 N042 uA741  ; pins In+ In- V+ V- OUT
R5 N043 N044 1k
R49 N043 N042 1k
R50 N016 White_noise 150k
.model D D
.lib standard.dio
.model NPN NPN
.model PNP PNP
.lib standard.bjt
.tran 1
*.include C:\Program Files\LTC\LTspiceXVII\lib\sub\LTC.lib
*.include C:\Program Files\LTC\LTspiceXVII\lib\sym\Opamps\opamp2
.wave "testwav2.wav" 16 44.1K V(output)
.wave "t_output.wav" 16 44.1K V(output_T)
.wave "testpoint2.wav" 16 44.1K V(testpoint2)
.inc uA741.sub
.lib NE555.sub
.backanno
.end